# EAGLE design 8266_ultrasonic (EAGLE 6.6.0)
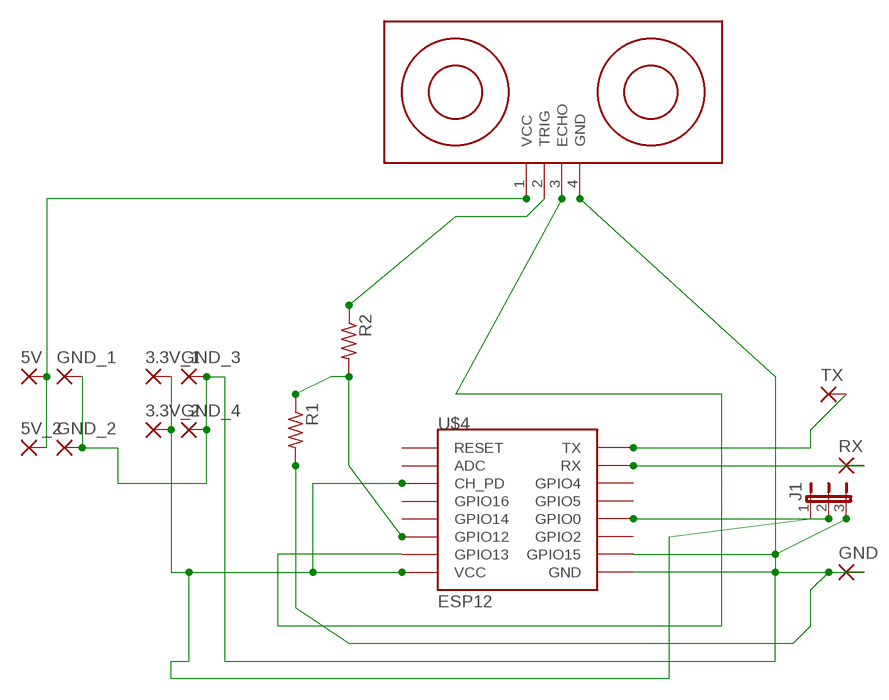
[diagram p0: schematic, sheet 1]

## Parts
3.3V_1  2,15/1,0  [2,15/1,0]
3.3V_2  2,15/1,0  [2,15/1,0]
5V  2,15/1,0  [2,15/1,0]
5V_2  2,15/1,0  [2,15/1,0]
GND  2,15/1,0  [2,15/1,0]
GND_1  2,15/1,0  [2,15/1,0]
GND_2  2,15/1,0  [2,15/1,0]
GND_3  2,15/1,0  [2,15/1,0]
GND_4  2,15/1,0  [2,15/1,0]
J1  JP2E  [JP2]
R1  R-US_0207/10  [0207/10]
R2  R-US_0207/10  [0207/10]
RX  2,15/1,0  [2,15/1,0]
TX  2,15/1,0  [2,15/1,0]
U$3  ULTRASONIC-HC-SR04#V  [ULTRASONIC-HC-SR04#V]
U$4  ESP12  [ESP12]

## Nets
5V: 5V.1(P) 5V_2.1(P) U$3.1(VCC)
GND: GND.1(P) GND_1.1(P) GND_2.1(P) GND_3.1(P) GND_4.1(P) J1.3 R1.2 U$3.4(GND) U$4.GND U$4.GPIO15
N$1: R2.1 U$3.2(TRIG)
N$2: J1.2 U$4.GPIO0
N$3: R1.1 R2.2 U$4.GPIO12
N$5: 3.3V_1.1(P) 3.3V_2.1(P) J1.1 U$4.CH_PD U$4.VCC
N$6: U$3.3(ECHO) U$4.GPIO13
RX: RX.1(P) U$4.RX
TX: TX.1(P) U$4.TX
Unconnected: U$4.ADC U$4.GPIO2 U$4.GPIO4 U$4.GPIO5 U$4.GPIO14 U$4.GPIO16 U$4.RESET

## Library data of the parts
3.3V_1 3.3V_2 5V 5V_2 GND GND_1-GND_4 RX TX = wirepad:2,15/1,0: THROUGH-HOLE PAD
J1 = jumper:JP2E: JUMPER
R1 R2 = rcl:R-US_: RESISTOR, American symbol
U$3 = diy-modules:ULTRASONIC-HC-SR04: Ultrasonic Ranging Module HC-SR04
U$4 = esp8266modules:ESP12: ESP8266 Wifi module 12

## Board
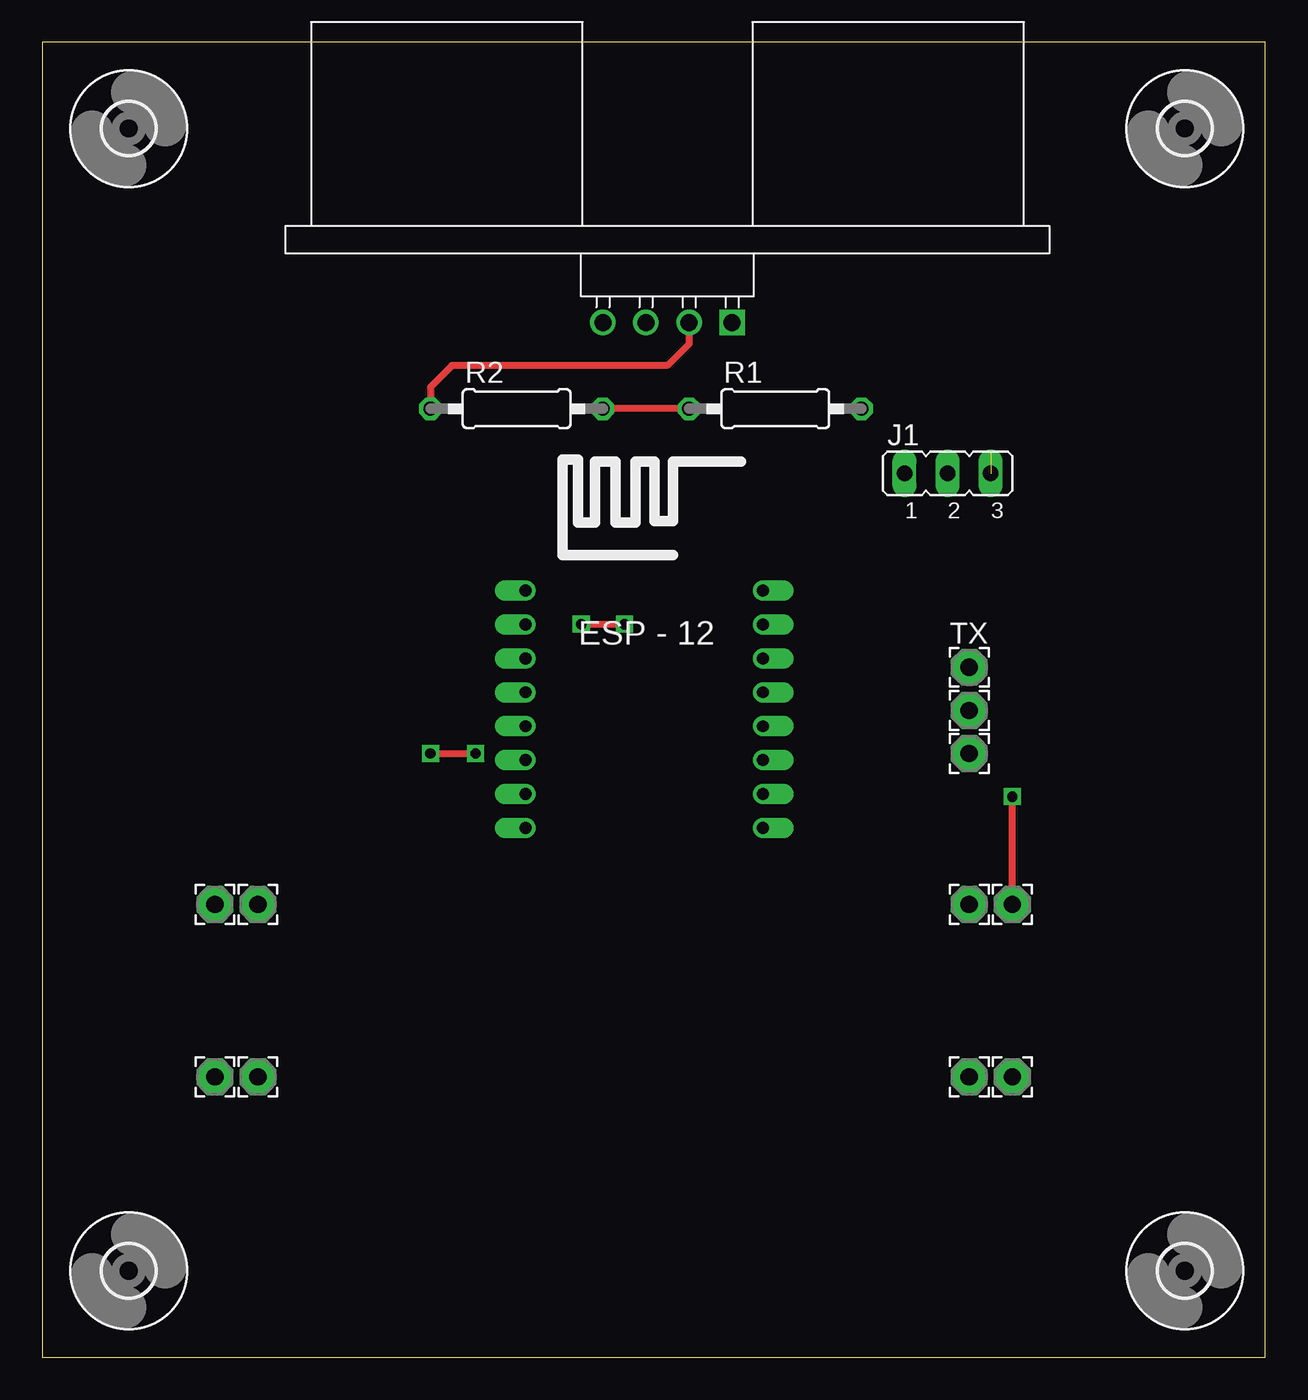
[diagram p1: board, top side]
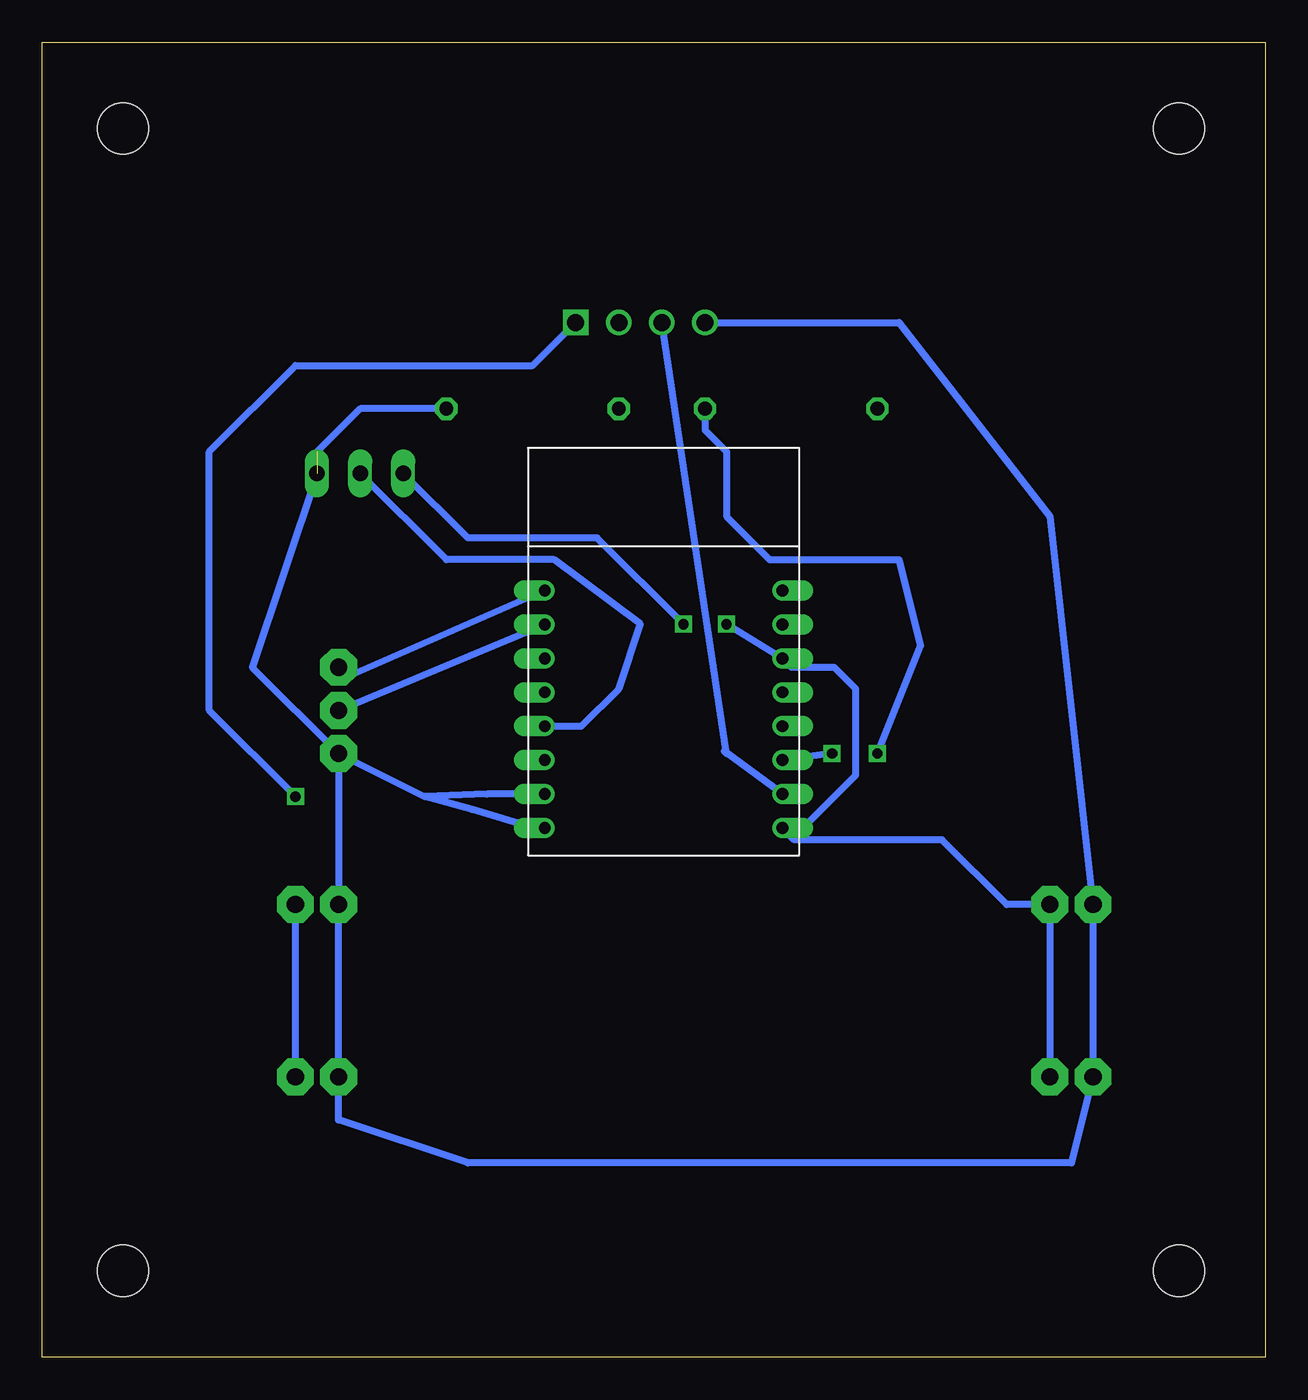
[diagram p2: board, bottom side, seen from below]

Size 72.06 x 77.46 mm. Coordinates in mm from the lower left corner, seen from the top.
Outline: 0,0 72.06,0 72.06,77.46 0,77.46 0,0
Copper layers (1*16): Top 0.035mm / dielectric 1.5mm / Bottom 0.035mm
Design rules "default *": minimum track width 10mil, minimum drill 13mil, track to track 8mil, track to pad 8mil, pad to pad 8mil, via to via 8mil, smd to smd 8mil, copper to edge 40mil, drill to drill 8mil, minimum pad ring 10mil, minimum via ring 8mil, stop-mask expansion 4mil, vias tented up to drill 0mil, thermal gap 10mil

### Footprints (pad centres in the part's own frame; a part is rotated, then mirrored left to right if it is on the bottom)
2,15/1,0 = drill 1.016 pad 2.159 octagon: 1 0,0
JP2 = drill 0.914 long: 1 -2.54,0; 2 0,0; 3 2.54,0
0207/10 = drill 0.813 octagon: 1 -5.08,0; 2 5.08,0
3,0 = hole 3: 0,0
ULTRASONIC-HC-SR04#V = drill 1 square: 1 -3.81,0 | drill 1: 2 -1.27,0; 3 1.27,0; 4 3.81,0
ESP12 = drill 0.7 offset: ADC -7.1,3.8; CH_PD -7.1,1.8; GND 6.9,-8.2; GPIO0 6.9,-2.2; GPIO2 6.9,-4.2; GPIO4 6.9,1.8; GPIO5 6.9,-0.2; GPIO12 -7.1,-4.2; GPIO13 -7.1,-6.2; GPIO14 -7.1,-2.2; GPIO15 6.9,-6.2; GPIO16 -7.1,-0.2; RESET -7.1,5.8; RX 6.9,3.8; TX 6.9,5.8; VCC -7.1,-8.2

### Placement (x,y rotation side)
3.3V_1  12.7,16.51 0 top
3.3V_2  12.7,26.67 0 top
5V  57.15,26.67 0 top
5V_2  57.15,16.51 0 top
GND  54.61,26.67 0 top
GND_1  54.61,16.51 0 top
GND_2  10.16,16.51 0 top
GND_3  54.61,35.56 0 top
GND_4  10.16,26.67 0 top
J1  53.34,52.07 0 top
R1  43.18,55.88 0 top
R2  27.94,55.88 0 top
RX  54.61,38.1 0 top
TX  54.61,40.64 0 top
U$1  [3,0]  5.08,72.39 0 top
U$2  [3,0]  5.08,5.08 0 top
U$3  36.83,60.96 180 top
U$4  35.56,39.37 0 top
U$5  [3,0]  67.31,5.08 0 top
U$6  [3,0]  67.31,72.39 0 top

### Tracks (layer width: path | path; a pad name or v marks a point on that pad's centre or on a via)
5V  (via drill 0.6)
  Top 0.406: 5V.1 v57.15,33.02
  Bottom 0.406: 5V_2.1 5V.1 | v57.15,33.02 62.23,38.1 62.23,53.34 57.15,58.42 43.18,58.42 U$3.1
GND  (1 unrouted)
  Bottom 0.406: U$3.4 21.59,60.96 12.7,49.53 GND_4.1 GND_2.1 11.43,11.43 46.99,11.43 54.61,13.97 GND_1.1 GND.1 GND_3.1 | J1.3 59.69,40.64 GND_3.1 | GND_3.1 49.53,33.02 | 49.53,33.02 46.74,32.26 43.11,31.17 U$4.GND | U$4.GPIO15 45.87,33.17 49.53,33.02 | R1.2 53.34,55.88 55.88,53.34
N$1
  Top 0.406: U$3.2 38.1,59.69 36.83,58.42 24.13,58.42 22.86,57.15 R2.1
N$2
  Bottom 0.406: U$4.GPIO0 40.3,37.17 38.1,39.37 36.83,43.18 41.91,46.99 48.26,46.99 J1.2
N$3  (via drill 0.6)
  Top 0.406: v22.86,35.56 v25.53,35.56 | R1.1 R2.2
  Bottom 0.406: R2.2 33.02,54.61 31.75,53.34 31.75,49.53 29.21,46.99 21.59,46.99 20.32,41.91 v22.86,35.56 | v25.53,35.56 U$4.GPIO12
N$5  (via drill 0.6)
  Top 0.406: v31.75,43.18 v34.29,43.18
  Bottom 0.406: 3.3V_1.1 3.3V_2.1 15.24,26.67 19.05,30.48 27.77,30.48 U$4.VCC 27.25,31.17 24.13,34.29 24.13,39.37 25.4,40.64 27.93,40.64 U$4.CH_PD v31.75,43.18 | v34.29,43.18 39.37,48.26 46.99,48.26 J1.1
N$6
  Bottom 0.406: U$4.GPIO13 31.9,35.71 31.75,35.56 U$3.3
RX
  Bottom 0.406: U$4.RX RX.1
TX
  Bottom 0.406: U$4.TX 54.06,40.09 TX.1